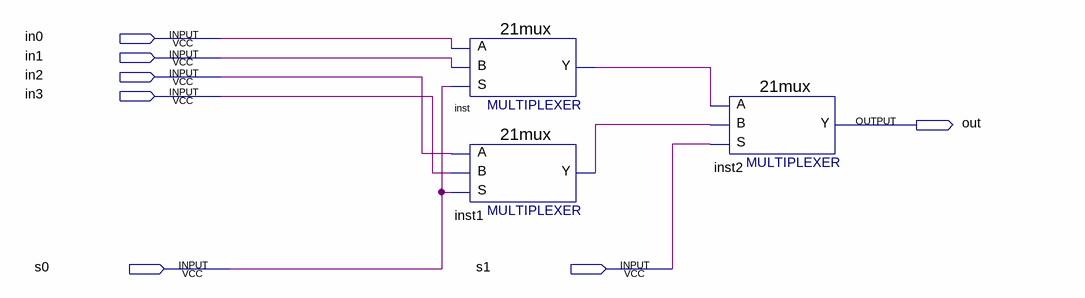
[diagram p0: schematic sheet]
// Quartus schematic 41mux.bdf as structural Verilog: 3 symbols, 7 pins
module \41mux  (
  input  in0,
  input  in1,
  input  in2,
  input  in3,
  input  s0,
  input  s1,
  output out
);

  wire inst1_y, inst_y;

  \21mux  inst (.S(s0), .B(in1), .A(in0), .Y(inst_y));
  \21mux  inst1 (.S(s0), .B(in3), .A(in2), .Y(inst1_y));
  \21mux  inst2 (.S(s1), .B(inst1_y), .A(inst_y), .Y(out));
endmodule
